# Altium schematic sheet SCH_3_Heartrate & Motion Sensors.SchDoc
size B
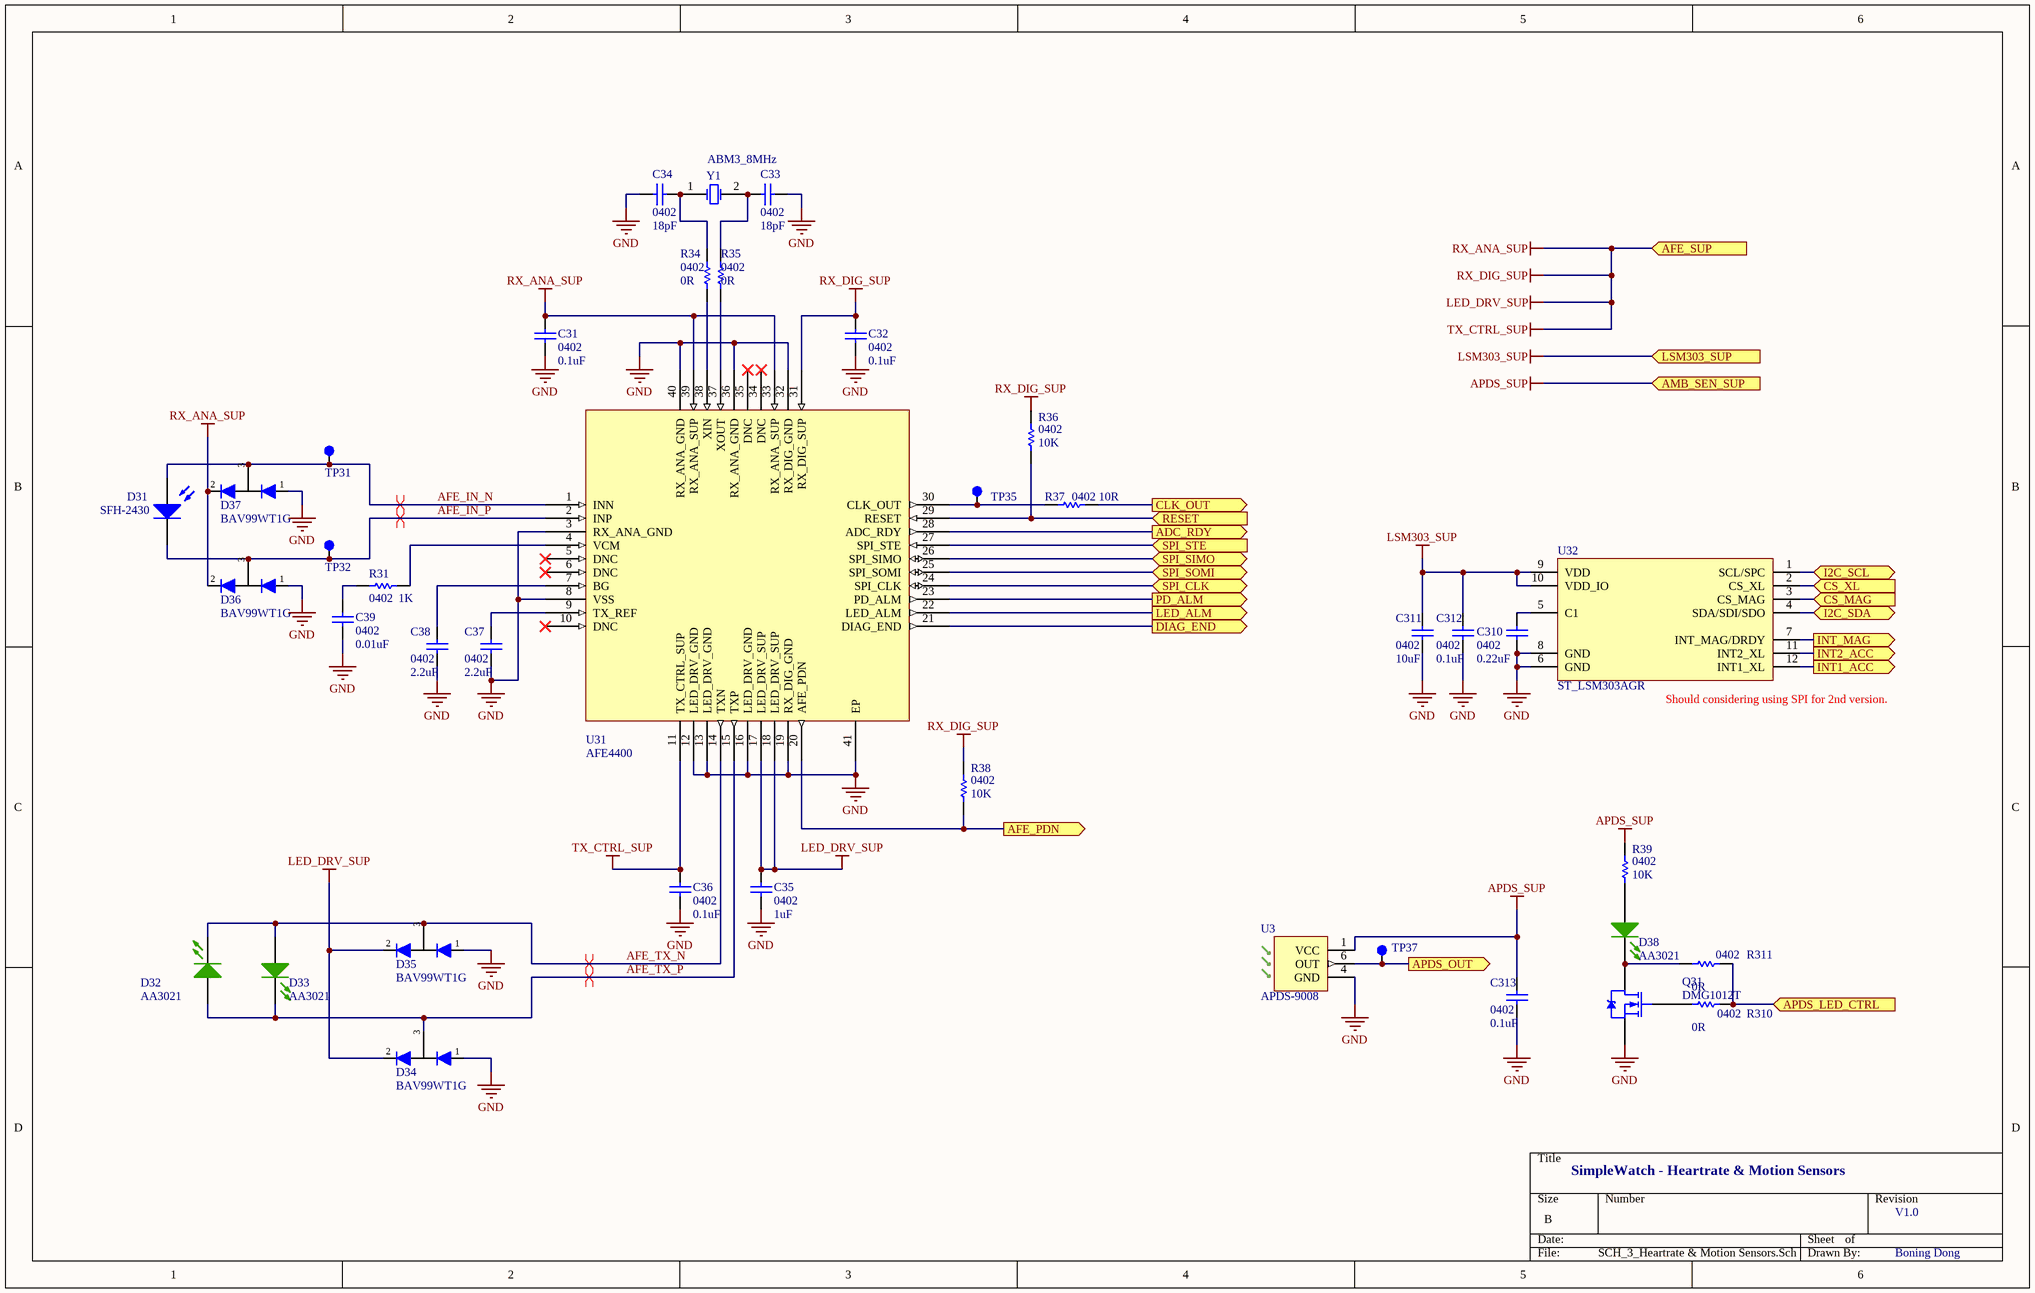
[diagram p0: SCH_3_Heartrate & Motion Sensors.SchDoc]

## Parts
C31  0402  value 0.1uF  [CAPC1005X07N]
C32  0402  value 0.1uF  [CAPC1005X07N]
C33  0402  value 18pF  [CAPC1005X07N]
C34  0402  value 18pF  [CAPC1005X07N]
C35  0402  value 1uF  [CAPC1005X07N]
C36  0402  value 0.1uF  [CAPC1005X07N]
C37  0402  value 2.2uF  [CAPC1005X07N]
C38  0402  value 2.2uF  [CAPC1005X07N]
C39  0402  value 0.01uF  [CAPC1005X07N]
C310  0402  value 0.22uF  [CAPC1005X07N]
C311  0402  value 10uF  [CAPC1005X07N]
C312  0402  value 0.1uF  [CAPC1005X07N]
C313  0402  value 0.1uF  [CAPC1005X07N]
D31  SFH-2430  [PHOTODIODE_OSRAM_SFH_2430]
D32  AA3021  [LED_KINGBRIGHT_AA3021]
D33  AA3021  [LED_KINGBRIGHT_AA3021]
D34  BAV99WT1G  [SOT65P200X125X90-3N]
D35  BAV99WT1G  [SOT65P200X125X90-3N]
D36  BAV99WT1G  [SOT65P200X125X90-3N]
D37  BAV99WT1G  [SOT65P200X125X90-3N]
D38  AA3021  [LED_KINGBRIGHT_AA3021]
Q31  DMG1012T  [SOT65P200X125X95-3N]
R31  0402  value 1K  [RESC1005X04N]
R34  0402  value 0R  [RESC1005X04N]
R35  0402  value 0R  [RESC1005X04N]
R36  0402  value 10K  [RESC1005X04N]
R37  0402  value 10R  [RESC1005X04N]
R38  0402  value 10K  [RESC1005X04N]
R39  0402  value 10K  [RESC1005X04N]
R310  0402  value 0R  [RESC1005X04N]
R311  0402  value 0R  [RESC1005X04N]
TP31  TP  [TP100]  (value not drawn)
TP32  TP  [TP100]  (value not drawn)
TP35  TP  [TP100]  (value not drawn)
TP37  TP  [TP100]  (value not drawn)
U3  APDS-9008  [APDS-9008]
U31  AFE4400  [QFN50P600X600X100-40N_HS410]
U32  ST_LSM303AGR  [LGA12S50P4X4_200X200X100]
Y1  ABM3_8MHz  [ABRACON_ABM3]

## Ports
ADC_RDY (out), AFE_PDN (out), AFE_SUP (in), AMB_SEN_SUP (in), APDS_LED_CTRL (in), APDS_OUT (out), CLK_OUT (out), CS_MAG (in), CS_XL (in), DIAG_END (out), I2C_SCL (bidir), I2C_SDA (bidir), INT1_ACC (out), INT2_ACC (out), INT_MAG (out), LED_ALM (out), LSM303_SUP (in), PD_ALM (out), RESET (in), SPI_CLK (bidir), SPI_SIMO (bidir), SPI_SOMI (bidir), SPI_STE (in)

## Nets
APDS_SUP: C313.2 R39.2 U3.1(VCC) ; port AMB_SEN_SUP
GND: C31.1 C32.1 C33.1 C34.2 C35.1 C36.1 C37.1 C38.1 C39.1 C310.1 C311.1 C312.1 C313.1 D34.1(ANODE) D35.1(ANODE) D36.1(ANODE) D37.1(ANODE) Q31.2(S) U3.4(GND) U31.3(RX_ANA_GND) U31.8(VSS) U31.12(LED_DRV_GND) U31.13(LED_DRV_GND) U31.16(LED_DRV_GND) U31.19(RX_DIG_GND) U31.32(RX_DIG_GND) U31.36(RX_ANA_GND) U31.40(RX_ANA_GND) U31.41(EP) U32.6(GND) U32.8(GND)
LED_DRV_SUP: C31.2 C32.2 C35.2 C36.2 D34.2(ANODE) D35.2(ANODE) D36.2(ANODE) D37.2(ANODE) R36.2 R38.2 U31.11(TX_CTRL_SUP) U31.17(LED_DRV_SUP) U31.18(LED_DRV_SUP) U31.31(RX_DIG_SUP) U31.33(RX_ANA_SUP) U31.39(RX_ANA_SUP) ; port AFE_SUP  [also labelled RX_ANA_SUP, RX_DIG_SUP, TX_CTRL_SUP]
LSM303_SUP: C311.2 C312.2 U32.9(VDD) U32.10(VDD_IO) ; port LSM303_SUP
ADC_RDY: U31.28(ADC_RDY) ; port ADC_RDY
AFE_IN_N: D31.1(A) D37.3(ANODE) TP31.1 U31.1(INN)
AFE_IN_P: D31.2(K) D36.3(ANODE) TP32.1 U31.2(INP)
AFE_PDN: R38.1 U31.20(AFE_PDN) ; port AFE_PDN
AFE_TX_N: D32.2(K) D33.1(A) D35.3(ANODE) U31.14(TXN)
AFE_TX_P: D32.1(A) D33.2(K) D34.3(ANODE) U31.15(TXP)
APDS_LED_CTRL: R310.1 R311.1 ; port APDS_LED_CTRL
APDS_OUT: TP37.1 U3.6(OUT) ; port APDS_OUT
CLK_OUT: R37.1 ; port CLK_OUT
CS_MAG: U32.3(CS_MAG) ; port CS_MAG
CS_XL: U32.2(CS_XL) ; port CS_XL
DIAG_END: U31.21(DIAG_END) ; port DIAG_END
I2C_SCL: U32.1(SCL/SPC) ; port I2C_SCL
I2C_SDA: U32.4(SDA/SDI/SDO) ; port I2C_SDA
INT1_ACC: U32.12(INT1_XL) ; port INT1_ACC
INT2_ACC: U32.11(INT2_XL) ; port INT2_ACC
INT_MAG: U32.7(INT_MAG/DRDY) ; port INT_MAG
LED_ALM: U31.22(LED_ALM) ; port LED_ALM
PD_ALM: U31.23(PD_ALM) ; port PD_ALM
RESET: R36.1 U31.29(RESET) ; port RESET
SPI_CLK: U31.24(SPI_CLK) ; port SPI_CLK
SPI_SIMO: U31.26(SPI_SIMO) ; port SPI_SIMO
SPI_SOMI: U31.25(SPI_SOMI) ; port SPI_SOMI
SPI_STE: U31.27(SPI_STE) ; port SPI_STE
NetC33_2: C33.2 R35.2 Y1.2(OSC2)
NetC34_1: C34.1 R34.2 Y1.1(OSC1)
NetC37_2: C37.2 U31.9(TX_REF)
NetC38_2: C38.2 U31.7(BG)
NetC39_2: C39.2 R31.1
NetC310_2: C310.2 U32.5(C1)
NetD38_1: D38.1(A) R39.1
NetD38_2: D38.2(K) Q31.3(D) R311.2
NetQ31_1: Q31.1(G) R310.2
NetR31_2: R31.2 U31.4(VCM)
NetR34_1: R34.1 U31.38(XIN)
NetR35_1: R35.1 U31.37(XOUT)
NetR37_2: R37.2 TP35.1 U31.30(CLK_OUT)

Not connected (* = marked no-connect by the designer): U31 5(DNC)* 6(DNC)* 10(DNC)* 34(DNC)* 35(DNC)*

## Layout directives
differential pair; net class DIFF: AFE_IN_N, AFE_IN_P, AFE_TX_N, AFE_TX_P

## Notes on the sheet
- (near U32) Should considering using SPI for 2nd version.
- SimpleWatch - Heartrate & Motion Sensors
- V1.0
- Boning Dong

## Library data of the parts
C31-C39 C310-C313 = Cap: Capacitor; Published: 8-Jun-2000; LatestRevisionDate: 17-Jul-2002; LatestRevisionNote: Re-released for DXP Platform.; PackageReference: RAD-0.3; Publisher: Altium Limited; PackageDescription: Radial Cap, Thru-Hole; 2 Leads; 0.3 in Pin Spacing
D31 = Photo Sen: Photosensitive Diode; Published: 24-Mar-1999; LatestRevisionDate: 17-Jul-2002; LatestRevisionNote: Re-released for DXP Platform.; PackageReference: PIN2; Publisher: Altium Limited
D32 D33 D38 = LED_GREEN: General Green LED
D34-D37 = BAV99WT1: DIODE ARRAY GP 100V 215MA SC70-3
Q31 = DMG1012T-7: MOSFET N-CH 20V 630MA SOT-523; Manufacturer: Diodes; Rds On Max: 400mR; Input Capacitance: 60.67pF; Max Power Dissipation: 280mW; Rise Time: 7.4ns; Fall Time: 12.3ns; Turn-On Delay Time: 5.1ns; Turn-Off Delay Time: 26.7ns; Gate to Source Voltage (Vgs): 6V; Number of Elements: 1; Drain to Source Resistance: 300mR; Threshold Voltage: 1V; Element Configuration: Single; FET Type: 1 N-Channel; Supplier 1: Digi-Key; Manufacturer Part Number: DMG1012T-7; Stock 1: 0; Pricing 1: 1=0.36, 10=0.326, 100=0.1824, 500=0.0977, 1000=0.0665 (USD); Mount: Surface Mount; Case/Package: SOT-523; Number of Pins: 3; Weight: 7.1E-05oz; Contact Plating: Tin,Matte; Min Operating Temperature: -55°C; Max Operating Temperature: 150°C; Continuous Drain Current (ID): 630mA; Packaging: Tape and Reel; Drain to Source Voltage (Vdss): 20V; Package Quantity: 3000; Number of Channels: 1; Drain to Source Breakdown Voltage: 20V; Power Dissipation: 280mW; On-State Resistance: 400MR; Length: 1.7mm; Height: 0.8mm; Width: 0.85mm; Radiation Hardening: No; REACH SVHC: No SVHC; Lead Free: Lead Free; ComponentLink1URL: https://datasheet.ciiva.com/934/ds31783-934512.pdf; ComponentLink1Description: https://datasheet.ciiva.com/934/ds31783-934512.pdf; ComponentLink2URL: https://datasheet.ciiva.com/4442/ds31783-44973-4442944.pdf; ComponentLink2Description: https://datasheet.ciiva.com/4442/ds31783-44973-4442944.pdf; ComponentLink3URL: https://datasheet.ciiva.com/11174/ds31783-11174965.pdf; ComponentLink3Description: https://datasheet.ciiva.com/11174/ds31783-11174965.pdf; ComponentLink4URL: https://datasheet.ciiva.com/17324/ds31783-17324010.pdf; ComponentLink4Description: https://datasheet.ciiva.com/17324/ds31783-17324010.pdf; ComponentLink5URL: https://datasheet.ciiva.com/6383/ds31783-6383803.pdf; ComponentLink5Description: https://datasheet.ciiva.com/6383/ds31783-6383803.pdf; ComponentLink6URL: https://datasheet.ciiva.com/934/ds31783-934511.pdf; ComponentLink6Description: https://datasheet.ciiva.com/934/ds31783-934511.pdf
R31 R34-R39 R310 R311 = Res1: Resistor; Published: 8-Jun-2000; LatestRevisionDate: 17-Jul-2002; LatestRevisionNote: Re-released for DXP Platform.; PackageReference: AXIAL-0.3; Publisher: Altium Limited; PackageDescription: Axial Device, Thru-Hole; 2 Leads; 0.3 in Pin Spacing
TP31 TP32 TP35 TP37 = TP_A: Test Point dot type
U3 = APDS-9008: Optical Sensor Ambient 565nm Current 6-SMD, No Lead
U31 = AFE4400: Integrated Analog Front End (AFE) for Heart-Rate Monitors and Low-Cost Pulse Oximeters
U32 = ST_LSM303AGR: Accelerometer, Magnetometer, Temperature, 3 Axis Sensor I²C, SPI Output
Y1 = XTAL: Crystal Oscillator; Published: 8-Jun-2000; LatestRevisionDate: 17-Jul-2002; LatestRevisionNote: Re-released for DXP Platform.; PackageReference: R38; Publisher: Altium Limited; PackageDescription: Crystal, Thru-Hole; 2 Leads; Body 3.1 x 8.2 mm (Dia.xH)